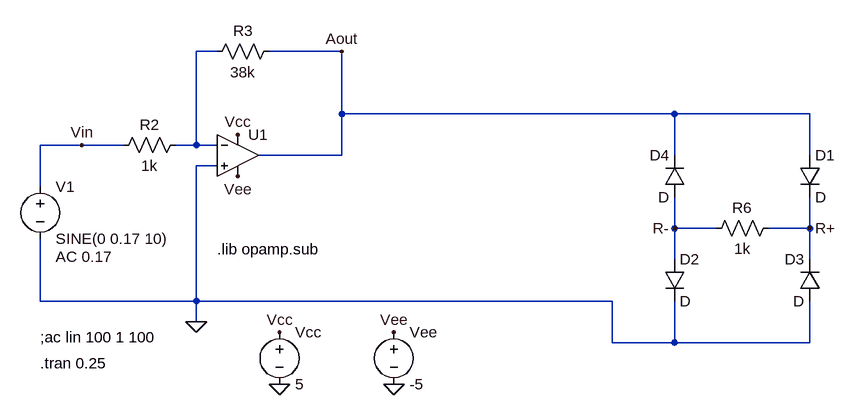
[diagram p0: schematic Inverting (Real) Amp with Bridge Rectifier.asc]
Inverting (Real) Amp with Bridge Rectifier.asc, the LTspice schematic file:
Version 4
SHEET 1 1684 680
WIRE -144 -208 -176 -208
WIRE 48 -208 -64 -208
WIRE 48 -112 48 -208
WIRE 560 -112 48 -112
WIRE 768 -112 560 -112
WIRE -352 -64 -416 -64
WIRE -288 -64 -352 -64
WIRE -176 -64 -176 -208
WIRE -176 -64 -208 -64
WIRE -144 -64 -176 -64
WIRE 48 -48 48 -112
WIRE 48 -48 -80 -48
WIRE 560 -48 560 -112
WIRE 768 -48 768 -112
WIRE -144 -32 -176 -32
WIRE -416 0 -416 -64
WIRE 560 64 560 16
WIRE 624 64 560 64
WIRE 768 64 768 16
WIRE 768 64 704 64
WIRE 560 112 560 64
WIRE 768 112 768 64
WIRE -416 176 -416 80
WIRE -176 176 -176 -32
WIRE -176 176 -416 176
WIRE 464 176 -176 176
WIRE -176 208 -176 176
WIRE 464 240 464 176
WIRE 560 240 560 176
WIRE 560 240 464 240
WIRE 768 240 768 176
WIRE 768 240 560 240
FLAG 48 -208 Aout
FLAG -352 -64 Vin
FLAG 768 64 R+
FLAG 560 64 R-
FLAG -176 208 0
FLAG -48 304 0
FLAG 128 304 0
FLAG -48 224 Vcc
FLAG 128 224 Vee
FLAG -112 -16 Vee
FLAG -112 -80 Vcc
SYMBOL voltage -416 -16 R0
WINDOW 123 24 124 Left 2
WINDOW 39 0 0 Left 0
SYMATTR Value2 AC 0.17
SYMATTR InstName V1
SYMATTR Value SINE(0 0.17 10)
SYMBOL res -192 -80 R90
WINDOW 0 0 56 VBottom 2
WINDOW 3 32 56 VTop 2
SYMATTR InstName R2
SYMATTR Value 1k
SYMBOL res -48 -224 R90
WINDOW 0 0 56 VBottom 2
WINDOW 3 32 56 VTop 2
SYMATTR InstName R3
SYMATTR Value 38k
SYMBOL diode 752 -48 R0
SYMATTR InstName D1
SYMBOL diode 544 112 R0
SYMATTR InstName D2
SYMBOL diode 784 176 R180
WINDOW 0 24 64 Left 2
WINDOW 3 24 0 Left 2
SYMATTR InstName D3
SYMBOL diode 576 16 R180
WINDOW 0 24 64 Left 2
WINDOW 3 24 0 Left 2
SYMATTR InstName D4
SYMBOL res 720 48 R90
WINDOW 0 0 56 VBottom 2
WINDOW 3 32 56 VTop 2
SYMATTR InstName R6
SYMATTR Value 1k
SYMBOL voltage -48 208 R0
WINDOW 123 0 0 Left 0
WINDOW 39 0 0 Left 0
SYMATTR InstName Vcc
SYMATTR Value 5
SYMBOL voltage 128 208 R0
WINDOW 123 0 0 Left 0
WINDOW 39 0 0 Left 0
SYMATTR InstName Vee
SYMATTR Value -5
SYMBOL OpAmps\\UniversalOpAmp -112 -48 R0
SYMATTR InstName U1
TEXT -416 272 Left 2 !.tran 0.25
TEXT -416 232 Left 2 !;ac lin 100 1 100
TEXT -144 96 Left 2 !.lib opamp.sub

The netlist it stands for:
* Inverting (Real) Amp with Bridge Rectifier.asc
V1 Vin 0 SINE(0 0.17 10) AC 0.17
R2 N001 Vin 1k
R3 Aout N001 38k
D1 Aout R+ D
D2 R- 0 D
D3 0 R+ D
D4 R- Aout D
R6 R+ R- 1k
Vcc Vcc 0 5
Vee Vee 0 -5
XU1 0 N001 Vcc Vee Aout level1 Avol=1Meg GBW=10Meg Vos=0 En=0 Enk=0 In=0 Ink=0 Rin=500Meg  ; pins In+ In- V+ V- OUT
.model D D
.lib standard.dio
.tran 0.25
;ac lin 100 1 100
.lib opamp.sub
.lib UniversalOpAmp1.lib
.backanno
.end

* Results of the author's LTspice run, read from the files saved beside the schematic
* Operating Point, zero values left out:
*   V(vcc) = 5 V
*   V(vee) = -5 V
*   I(Vee) = 10 nA
*   I(Vcc) = -10 nA
*   Ix(u1:3) = 10 nA
*   Ix(u1:4) = -10 nA
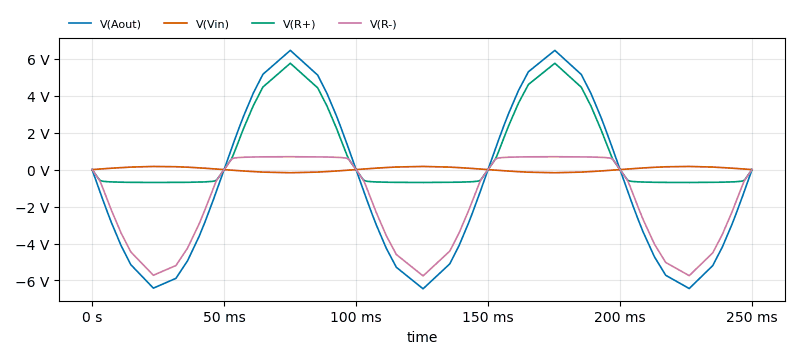
[diagram p1: Transient Analysis of Inverting (Real) Amp with Bridge Rectifier.asc, plotted from the saved traces]
* Transient Analysis, 1 run:
*   V(Aout): min -6.451 V, max 6.452 V, average -816 mV, rms 4.483 V, last -251.9 µV
*   V(Vin): min -169.8 mV, max 169.8 mV, average 21.48 mV, rms 118 mV, last 0 V
*   V(R+): min -697.2 mV, max 5.755 V, average 975 mV, rms 2.494 V, last -126 µV
*   V(R-): min -5.754 V, max 697.2 mV, average -1.791 V, rms 3.037 V, last -126 µV